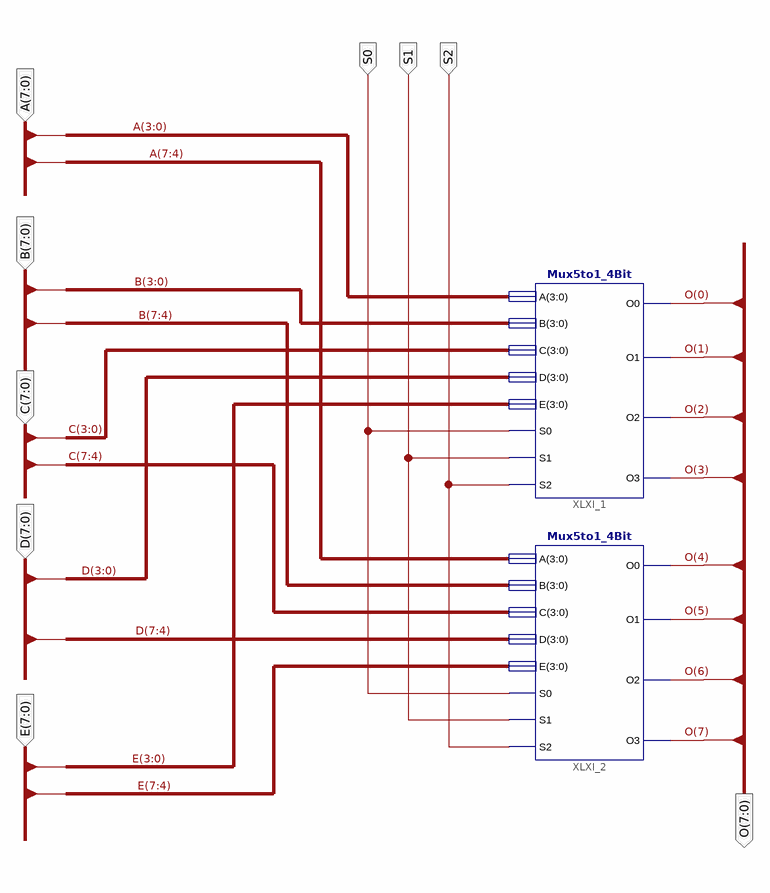
[diagram p0: schematic sheet 1]
// Xilinx ISE schematic Mux5to1_8Bit.sch (spartan3e) as structural Verilog: 2 symbols, 9 ports
module Mux5to1_8Bit (
  input  [7:0] C,
  input  [7:0] D,
  input  [7:0] E,
  input  [7:0] B,
  input  [7:0] A,
  input  S0,
  input  S1,
  input  S2,
  output [7:0] O
);

  Mux5to1_4Bit XLXI_1 (
    .S2(S2), .S1(S1), .S0(S0), .A(A[3:0]), .E(E[3:0]), .O0(O[0]), .O1(O[1]), .O2(O[2]), .O3(O[3]),
    .C(C[3:0]), .D(D[3:0]), .B(B[3:0]));
  Mux5to1_4Bit XLXI_2 (
    .S2(S2), .S1(S1), .S0(S0), .A(A[7:4]), .E(E[7:4]), .O0(O[4]), .O1(O[5]), .O2(O[6]), .O3(O[7]),
    .C(C[7:4]), .D(D[7:4]), .B(B[7:4]));
endmodule
